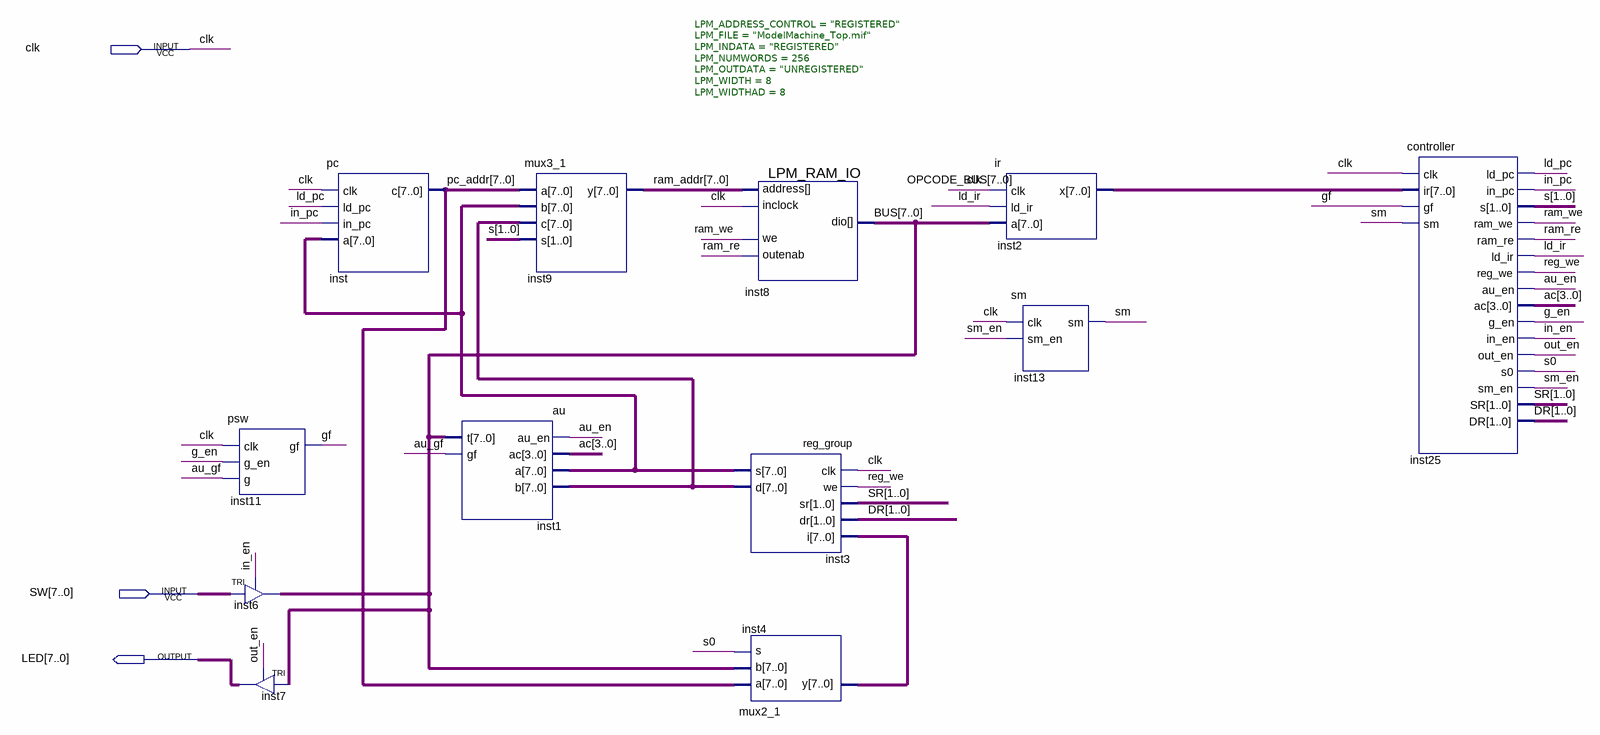
[diagram p0: schematic sheet]
// Quartus schematic ModelMachine_Top.bdf as structural Verilog: 12 symbols, 3 pins
module ModelMachine_Top (
  input  clk,
  input  [7:0] SW,
  output [7:0] LED
);

  wire au_en, au_gf, g_en, gf, in_en, in_pc, ld_ir, ld_pc, out_en, ram_re, ram_we, reg_we, sm, sm_en;
  wire [1:0] DR, s, SR;
  wire [3:0] ac;
  wire [7:0] BUS, inst3_d, inst3_s, inst4_y, OPCODE_BUS, pc_addr, ram_addr;

  psw inst11 (.clk(clk), .g_en(g_en), .g(au_gf), .gf(gf));
  TRI inst6[7:0] (.IN(SW), .OE(in_en), .OUT(BUS));
  TRI inst7[7:0] (.IN(BUS), .OE(out_en), .OUT(LED));
  pc inst (.clk(clk), .ld_pc(ld_pc), .in_pc(in_pc), .a(inst3_s), .c(pc_addr));
  au inst1 (.au_en(au_en), .ac(ac), .a(inst3_s), .b(inst3_d), .t(BUS), .gf(au_gf));
  mux3_1 inst9 (.a(pc_addr), .b(inst3_s), .c(inst3_d), .s(s), .y(ram_addr));
  LPM_RAM_IO #(.LPM_ADDRESS_CONTROL("REGISTERED"), .LPM_FILE("ModelMachine_Top.mif"), .LPM_INDATA("REGISTERED"), .LPM_NUMWORDS(256), .LPM_OUTDATA("UNREGISTERED"), .LPM_WIDTH(8), .LPM_WIDTHAD(8)) inst8 (
    .address(ram_addr), .inclock(clk), .we(ram_we), .outenab(ram_re), .dio(BUS));
  reg_group inst3 (.clk(clk), .we(reg_we), .sr(SR), .dr(DR), .i(inst4_y), .s(inst3_s), .d(inst3_d));
  mux2_1 inst4 (.a(pc_addr), .b(BUS), .s(s[0]), .y(inst4_y));
  ir inst2 (.clk(clk), .ld_ir(ld_ir), .a(BUS), .x(OPCODE_BUS));
  sm inst13 (.clk(clk), .sm_en(sm_en), .sm(sm));
  controller inst25 (
    .clk(clk), .ir(OPCODE_BUS), .gf(gf), .sm(sm), .ld_pc(ld_pc), .in_pc(in_pc), .s(s), .ram_we(ram_we),
    .ram_re(ram_re), .ld_ir(ld_ir), .reg_we(reg_we), .au_en(au_en), .ac(ac), .g_en(g_en), .in_en(in_en),
    .out_en(out_en), .s0(s[0]), .sm_en(sm_en), .SR(SR), .DR(DR));
endmodule
